# Altium schematic sheet DSO_Clock.SchDoc: Schematic_Name
size A4; CompanyName: University of Melbourne; Engineer: Your Name Here; DocumentNumber: 1; Revision: 0.1; SheetNumber: 1; SheetTotal: 1; Title_Project: Project_Title; StudentNo: Student No.
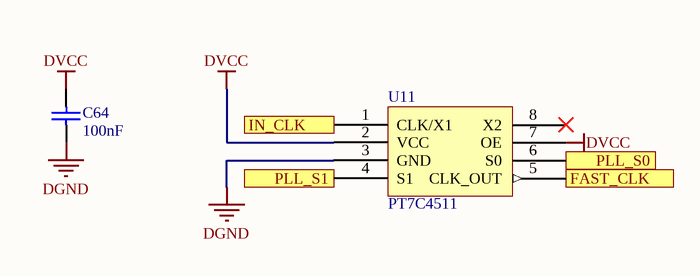
[diagram p0: DSO_Clock.SchDoc]

## Parts
C64  100nF  [0805C]
U11  PT7C4511  [SOIC-8]

## Ports
FAST_CLK (out), IN_CLK (in), PLL_S0 (in), PLL_S1 (in)

## Nets
DGND: C64.2 U11.3(GND)
DVCC: C64.1 U11.2(VCC) U11.7(OE)
FAST_CLK: U11.5(CLK_OUT) ; port FAST_CLK
IN_CLK: U11.1(CLK/X1) ; port IN_CLK
PLL_S0: U11.6(S0) ; port PLL_S0
PLL_S1: U11.4(S1) ; port PLL_S1

Not connected (* = marked no-connect by the designer): U11 8(X2)*

## Library data of the parts
C64 = C: Capacitor; Reviewed by: RM - 2018/08/05; Revision: July-2002: Re-released for DXP Platform.; Value: 100nF; Supplier 1: *; Supplier Part Number 1: *
U11 = PT7C4511: PLL Clock Multiplier; Reviewed by: RM - 2018/08/05; Supplier 1: Digi-Key; Supplier Part Number 1: PT7C4511WEXDICT-ND